# Altium schematic sheet AFE.SchDoc: AFE
size A4; Author: Samuel López Asunción; ProjectName: Mio
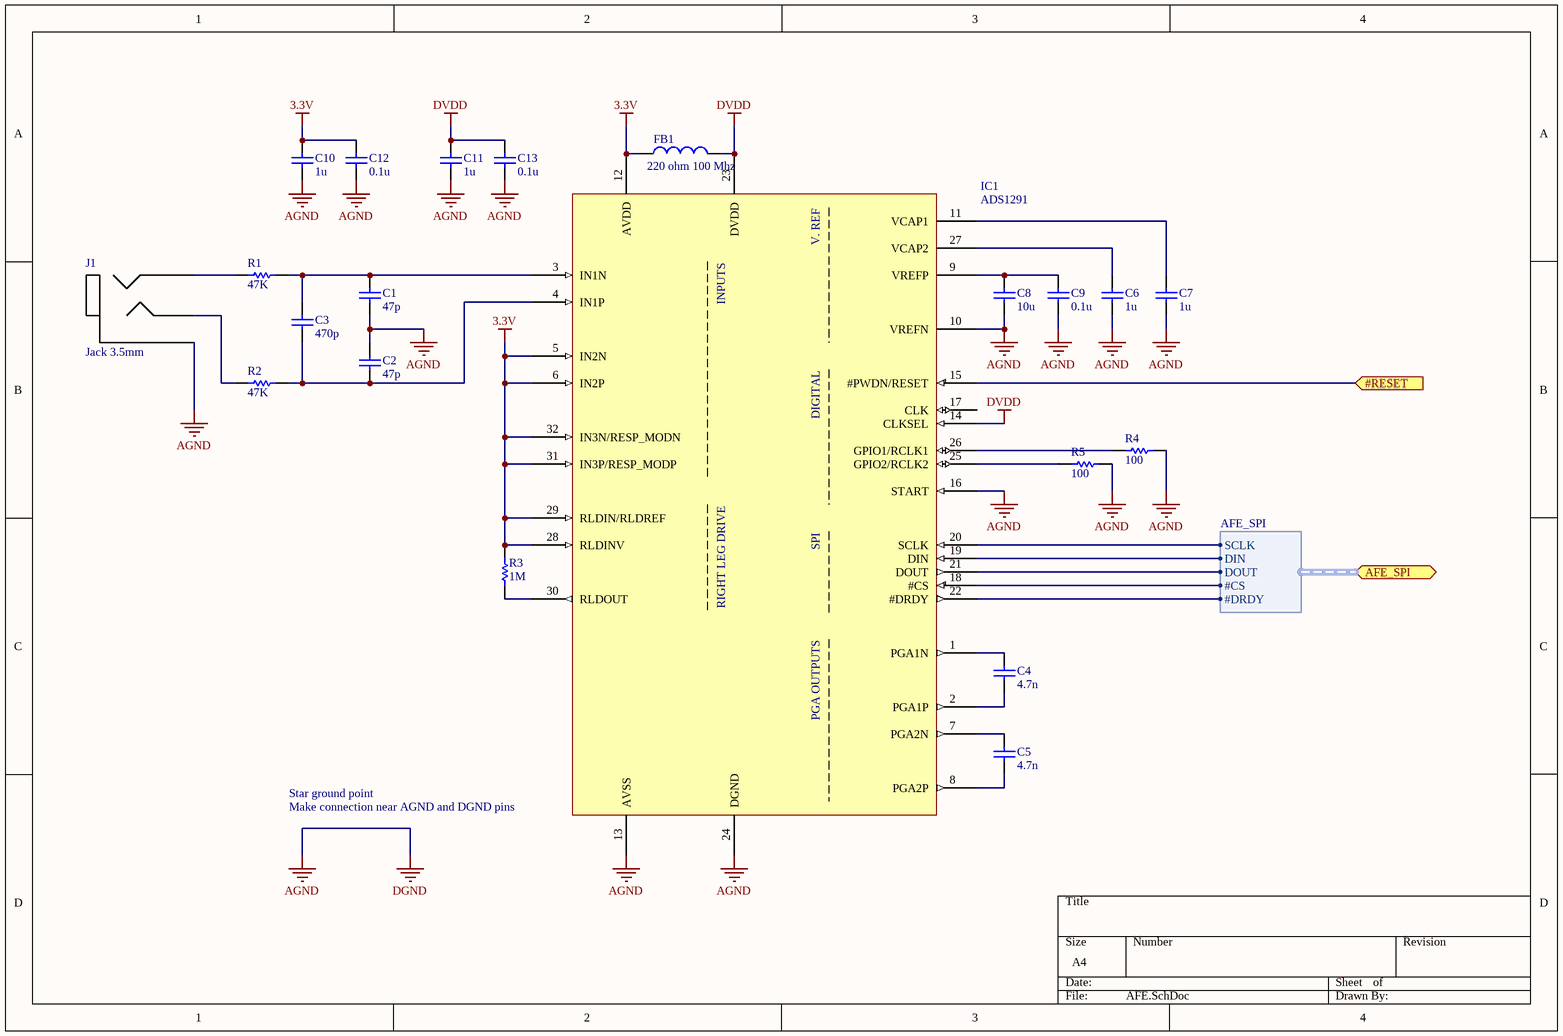
[diagram p0: AFE.SchDoc]

## Parts
C1  47p  [0805 CAP]
C2  47p  [0805 CAP]
C3  470p  [0805 CAP]
C4  4.7n  [0805 CAP]
C5  4.7n  [0805 CAP]
C6  1u  [0805 CAP]
C7  1u  [0805 CAP]
C8  10u  [0805 CAP]
C9  0.1u  [0805 CAP]
C10  1u  [0805 CAP]
C11  1u  [0805 CAP]
C12  0.1u  [0805 CAP]
C13  0.1u  [0805 CAP]
FB1  220 ohm 100 Mhz  [0805 Ind]
IC1  ADS1291  [TSQFP50P700X700X120-32N]
J1  Jack 3.5mm  [Jack 3.5mm]
R1  47K  [0805 Res]
R2  47K  [0805 Res]
R3  1M  [0805 Res]
R4  100  [0805 Res]
R5  100  [0805 Res]

## Ports
#RESET (in), AFE_SPI (harness AFE_SPI)

## Harnesses
AFE_SPI: SCLK, DIN, DOUT, #CS, #DRDY

## Nets
3.3V: C10.2 C12.2 FB1.1 IC1.5(IN2N) IC1.6(IN2P) IC1.12(AVDD) IC1.28(RLDINV) IC1.29(RLDIN/RLDREF) IC1.31(IN3P/RESP_MODP) IC1.32(IN3N/RESP_MODN) R3.2
AGND: C1.1 C2.2 C6.1 C7.1 C8.1 C9.1 C10.1 C11.1 C12.1 C13.1 IC1.10(VREFN) IC1.13(AVSS) IC1.16(START) IC1.24(DGND) J1.1(Sleeve) R4.1 R5.1  [also labelled DGND]
DVDD: C11.2 C13.2 FB1.2 IC1.14(CLKSEL) IC1.23(DVDD)
#RESET: IC1.15(#PWDN/RESET) ; port #RESET
NetC1_2: C1.2 C3.2 IC1.3(IN1N) R1.2
NetC2_1: C2.1 C3.1 IC1.4(IN1P) R2.2
NetC4_1: C4.1 IC1.2(PGA1P)
NetC4_2: C4.2 IC1.1(PGA1N)
NetC5_1: C5.1 IC1.8(PGA2P)
NetC5_2: C5.2 IC1.7(PGA2N)
NetC6_2: C6.2 IC1.27(VCAP2)
NetC7_2: C7.2 IC1.11(VCAP1)
NetC8_2: C8.2 C9.2 IC1.9(VREFP)
NetIC1_18: IC1.18(#CS) ; port AFE_SPI.#CS
NetIC1_19: IC1.19(DIN) ; port AFE_SPI.DIN
NetIC1_20: IC1.20(SCLK) ; port AFE_SPI.SCLK
NetIC1_21: IC1.21(DOUT) ; port AFE_SPI.DOUT
NetIC1_22: IC1.22(#DRDY) ; port AFE_SPI.#DRDY
NetIC1_25: IC1.25(GPIO2/RCLK2) R5.2
NetIC1_26: IC1.26(GPIO1/RCLK1) R4.2
NetIC1_30: IC1.30(RLDOUT) R3.1
NetJ1_2: J1.2(Tip) R2.1
NetJ1_3: J1.3(Ring) R1.1

Not connected (* = marked no-connect by the designer): IC1 17(CLK)

## Notes on the sheet
- Star ground point
- (near IC1) Make connection near AGND and DGND pins
- (in symbol ADS1291) V. REF; INPUTS; DIGITAL; RIGHT LEG DRIVE; SPI; PGA OUTPUTS

## Library data of the parts
C1-C13 = Cap
  C1 C2: Value: 47p
  C3: Value: 470p
  C4 C5: Value: 4.7n
  C6 C7 C10 C11: Value: 1u
  C8: Value: 10u
  C9 C12 C13: Value: 0.1u
FB1 = Ferrita: INDUCTOR, 0.04OHM, 3A, 0805; Value: 220 ohm 100 Mhz
R1-R5 = Res
  R1 R2: Value: 47K
  R3: Value: 1M
  R4 R5: Value: 100